# Altium schematic sheet PowerConvert.SchDoc
size A4
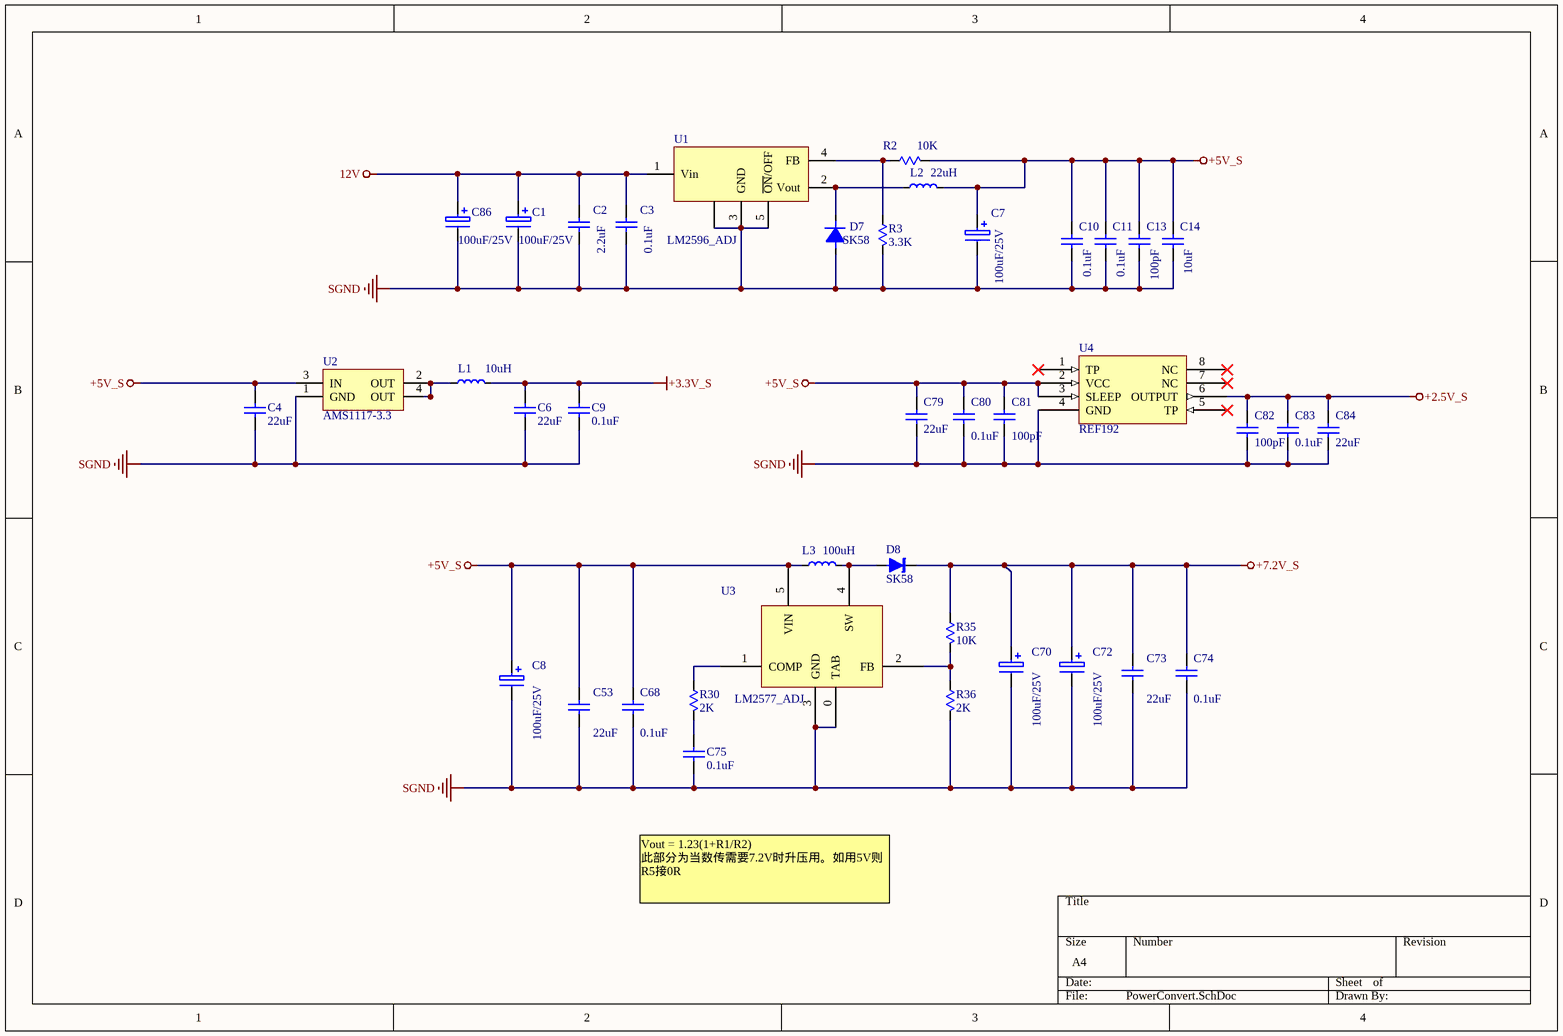
[diagram p0: PowerConvert.SchDoc]

## Parts
C1  100uF/25V  [CT7343-E-S]
C2  2.2uF  [C1206]
C3  0.1uF  [C0805]
C4  22uF  [C1206]
C6  22uF  [C1206]
C7  100uF/25V  [CT7343-E-S]
C8  100uF/25V  [CT7343-E-S]
C9  0.1uF  [C0805]
C10  0.1uF  [C0805]
C11  0.1uF  [C0805]
C13  100pF  [C0805]
C14  10uF  [C0805]
C53  22uF  [C1206]
C68  0.1uF  [C0805]
C70  100uF/25V  [CT7343-E-S]
C72  100uF/25V  [CT7343-E-S]
C73  22uF  [C1206]
C74  0.1uF  [C0805]
C75  0.1uF  [C0805]
C79  22uF  [C1206]
C80  0.1uF  [C0805]
C81  100pF  [C0805]
C82  100pF  [C0805]
C83  0.1uF  [C0805]
C84  22uF  [C1206]
C86  100uF/25V  [CT7343-E-S]
D7  SK58  [SMB]
D8  SK58  [SMB]
L1  10uH  [L0805-C]
L2  22uH  [L5050-P]
L3  100uH  [L5050-P]
R2  10K  [R0805]
R3  3.3K  [R0805]
R30  2K  [R0805]
R35  10K  [R0805]
R36  2K  [R0805]
U1  LM2596_ADJ  [TO263]
U2  AMS1117-3.3  [SOT-223]
U3  LM2577_ADJ  [TO263]
U4  REF192  [SO-8]

## Nets
12V: C1.1 C2.2 C3.2 C86.1 U1.1(Vin)
+2.5V_S: C82.2 C83.2 C84.2 U4.6(OUTPUT)
+3.3V_S: C6.1 C9.2 L1.1
+5V_S: C4.1 C7.1 C8.1 C10.2 C11.2 C13.2 C14.2 C53.1 C68.2 C79.2 C80.2 C81.2 L2.1 L3.1 R2.1 U2.3(IN) U3.5(VIN) U4.2(VCC) U4.3(SLEEP)
+7.2V_S: C70.1 C72.1 C73.1 C74.2 D8.2(K) R35.1
SGND: C1.2 C2.1 C3.1 C4.2 C6.2 C7.2 C8.2 C9.1 C10.1 C11.1 C13.1 C14.1 C53.2 C68.1 C70.2 C72.2 C73.2 C74.1 C75.1 C79.1 C80.1 C81.1 C82.1 C83.1 C84.1 C86.2 D7.1(A) R3.1 R36.2 U1.0(GND) U1.3(GND) U1.5(~{ON}/OFF) U2.1(GND) U3.0(TAB) U3.3(GND) U4.4(GND)
NetC75_2: C75.2 R30.2
NetD7_2: D7.2(K) L2.2 U1.2(Vout)
NetD8_1: D8.1(A) L3.2 U3.4(SW)
NetL1_2: L1.2 U2.2(OUT) U2.4(OUT)
NetR2_2: R2.2 R3.2 U1.4(FB)
NetR30_1: R30.1 U3.1(COMP)
NetR35_2: R35.2 R36.1 U3.2(FB)

Not connected (* = marked no-connect by the designer): U4 1(TP)* 5(TP)* 7(NC)* 8(NC)*

## Notes on the sheet
- Vout = 1.23(1+R1/R2)
  此部分为当数传需要7.2V时升压用。如用5V则R5接0R

## Library data of the parts
C1 C7 C8 C70 C72 C86 = ELECTRO: Electrolytic Capacitor
C2-C4 C6 C9-C11 C13 C14 C53 C68 C73-C75 C79-C84 = CAP: Published: 8-Jun-2000; LatestRevisionDate: 17-Jul-2002; LatestRevisionNote: Re-released for DXP Platform.; PackageReference: RAD-0.3; Publisher: Altium Limited
  C2: Value: 2.2uF
  C3 C9-C11 C68 C74 C75 C80 C83: Value: 0.1uF
  C4 C6 C53 C73 C79 C84: Value: 22uF
  C13 C81 C82: Value: 100pF
  C14: Value: 10uF
D7 = DIODE1: Diode
D8 = DIODE-SCHOTTKY: Schottky barrier rectifier
L1-L3 = INDUCTOR: Code_IEC: 1005; Published: 8-Jun-2000; LatestRevisionDate: 17-Jul-2002; LatestRevisionNote: Re-released for DXP Platform.; PackageReference: 0402-A; Publisher: Altium Limited; Code_JEITA: 0402
  L1: Value: 10uH
  L2: Value: 22uH
  L3: Value: 100uH
R2 R3 R30 R35 R36 = RES: Resistor; Published: 8-Jun-2000; LatestRevisionDate: 17-Jul-2002; LatestRevisionNote: Re-released for DXP Platform.; PackageReference: AXIAL-0.3; Publisher: Altium Limited
  R2 R35: Value: 10K
  R3: Value: 3.3K
  R30 R36: Value: 2K
U1 = LM2575
U2 = REG1117-3.3: 800mA and 1A Low Dropout Positive Regulator 2.85V, 3.3V, 5V, and Adjustable; Package Information: Latest Revision: revC; Published: 8-Jun-2000; Revision: 17-Jul-2002: Re-released for DXP Platform.; Datasheet: Latest Revision: Sep-1997; Package Reference: ZZ311; Publisher: Altium Limited
U3 = LM2577
U4 = REF192/5/7